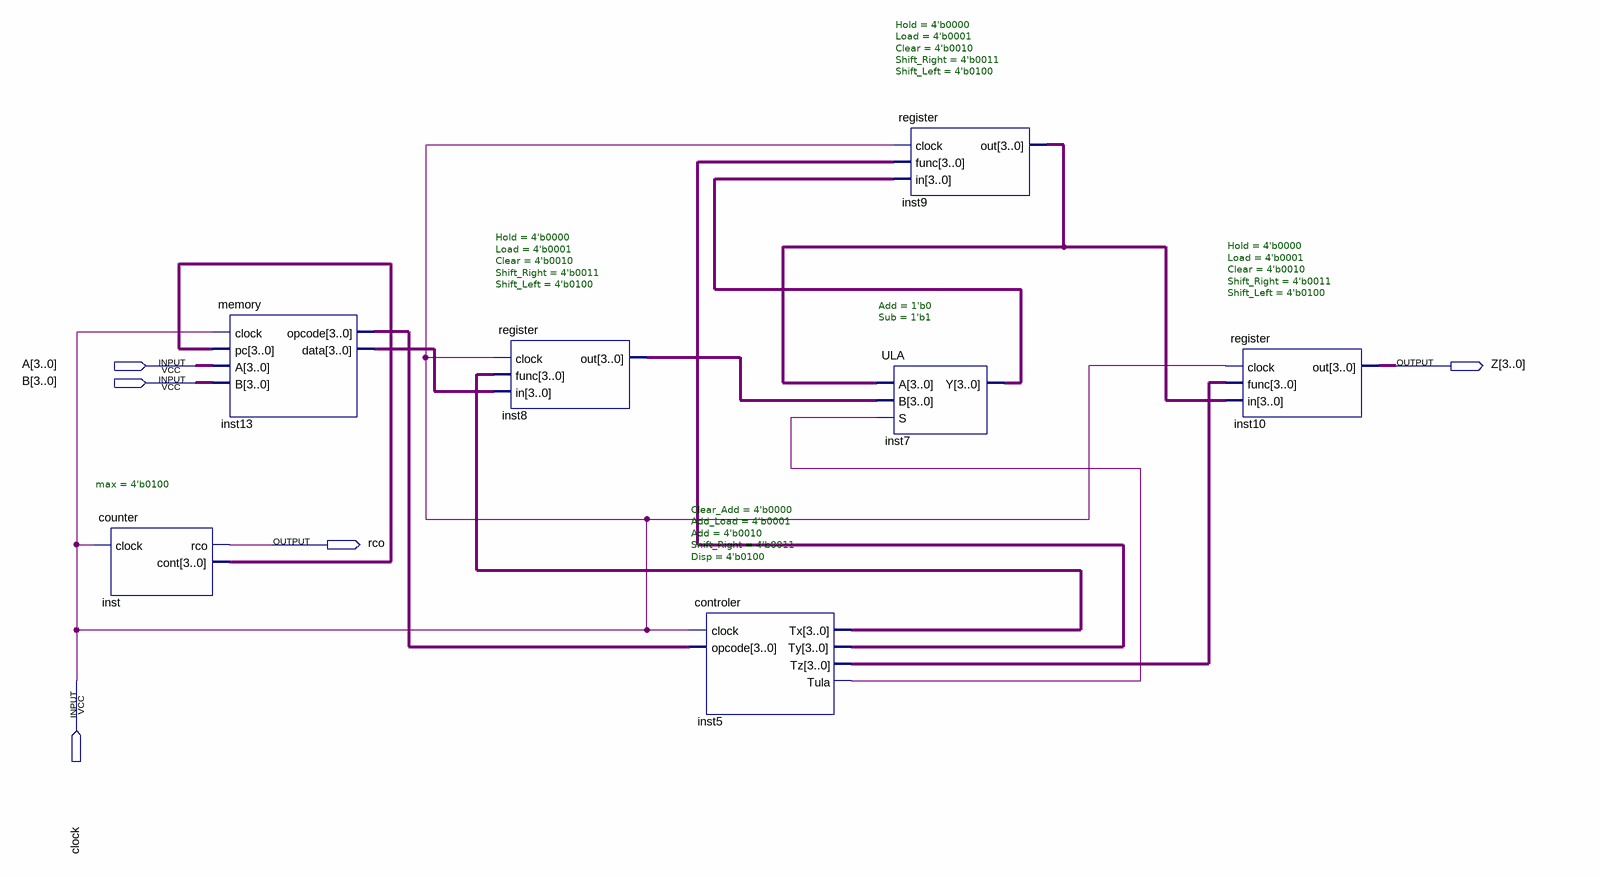
[diagram p0: schematic sheet]
// Quartus schematic CPU.bdf as structural Verilog: 7 symbols, 5 pins
module CPU (
  input  [3:0] A,
  input  [3:0] B,
  input  clock,
  output [3:0] Z,
  output rco
);

  wire inst5_tula;
  wire [3:0] inst5_tx, inst5_ty, inst5_tz, inst7_y, inst8_out, inst9_out, inst13_data, inst13_opcode,
       inst_cont;

  counter #(.max(4'b0100)) inst (.clock(clock), .rco(rco), .cont(inst_cont));
  memory inst13 (.clock(clock), .pc(inst_cont), .A(A), .B(B), .opcode(inst13_opcode), .data(inst13_data));
  register #(.Hold(4'b0000), .Load(4'b0001), .Clear(4'b0010), .Shift_Right(4'b0011), .Shift_Left(4'b0100)) inst8 (
    .clock(clock), .func(inst5_tx), .in(inst13_data), .out(inst8_out));
  controler #(.Clear_Add(4'b0000), .Add_Load(4'b0001), .Add(4'b0010), .Shift_Right(4'b0011), .Disp(4'b0100)) inst5 (
    .clock(clock), .opcode(inst13_opcode), .Tx(inst5_tx), .Ty(inst5_ty), .Tz(inst5_tz), .Tula(inst5_tula));
  register #(.Hold(4'b0000), .Load(4'b0001), .Clear(4'b0010), .Shift_Right(4'b0011), .Shift_Left(4'b0100)) inst9 (
    .clock(clock), .func(inst5_ty), .in(inst7_y), .out(inst9_out));
  ULA #(.Add(1'b0), .Sub(1'b1)) inst7 (.A(inst9_out), .B(inst8_out), .S(inst5_tula), .Y(inst7_y));
  register #(.Hold(4'b0000), .Load(4'b0001), .Clear(4'b0010), .Shift_Right(4'b0011), .Shift_Left(4'b0100)) inst10 (
    .clock(clock), .func(inst5_tz), .in(inst9_out), .out(Z));
endmodule
